# Altium project Sensor.PrjPcb
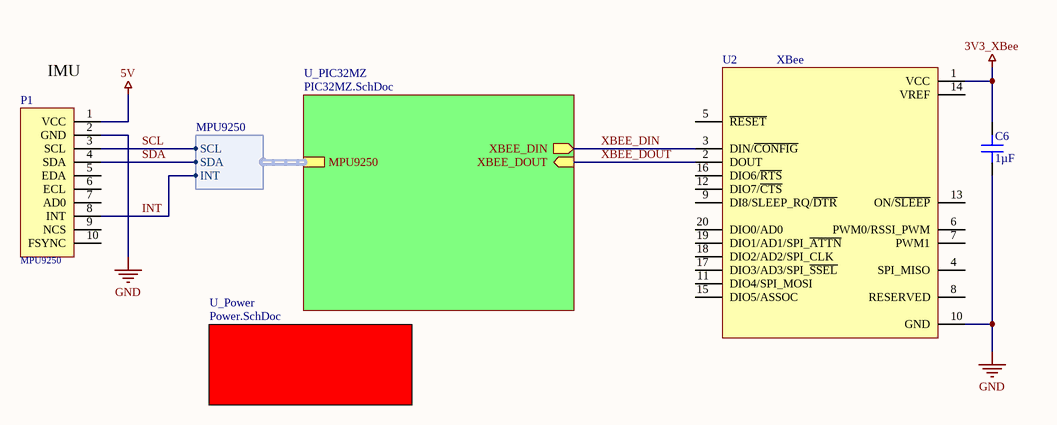
[diagram p0: Top.SchDoc]
5 sheets, 53 parts. Net scope: hierarchical (ports join the sheet entries above them; power ports are global).
Board file: Sensor.PcbDoc
Sheets:
  Top.SchDoc
    U_Power = Power.SchDoc
      U_5V_buck = 5V_buck.SchDoc
      U_3V3_LDO = 3V3_LDO.SchDoc
      U_3V3_LDO = 3V3_LDO.SchDoc
    U_PIC32MZ = PIC32MZ.SchDoc

## Sheet Top.SchDoc
size A; SheetNumber: 1; SheetTotal: 5

### Parts
C6  1µF  [CAP 0603_1608]
P1  MPU9250  [MPU 9150 - 10 pin 0.1"]
U2  XBee  [XBee]

### Sub-sheets
U_PIC32MZ = PIC32MZ.SchDoc: XBEE_DIN (out), XBEE_DOUT (in), MPU9250 (harness MPU9250)
U_Power = Power.SchDoc: no entries

### Harnesses
MPU9250: INT, SCL, SDA

### Nets
3V3_XBee: C6.2 U2.1(VCC)
5V: P1.1(VCC)
GND: C6.1 P1.2(GND) U2.10(GND)
INT: P1.8(INT) ; sheet U_PIC32MZ/MPU9250.INT
SCL: P1.3(SCL) ; sheet U_PIC32MZ/MPU9250.SCL
SDA: P1.4(SDA) ; sheet U_PIC32MZ/MPU9250.SDA
XBEE_DIN: U2.3(DIN/~{CONFIG}) ; sheet U_PIC32MZ/XBEE_DIN
XBEE_DOUT: U2.2(DOUT) ; sheet U_PIC32MZ/XBEE_DOUT

Not connected (* = marked no-connect by the designer): P1 5(EDA) 6(ECL) 7(AD0) 9(NCS) 10(FSYNC); U2 4(SPI_MISO) 5(~{RESET}) 6(PWM0/RSSI_PWM) 7(PWM1) 8(RESERVED) 9(DI8/SLEEP_RQ/~{DTR}) 11(DIO4/SPI_MOSI) 12(DIO7/~{CTS}) 13(ON/~{SLEEP}) 14(VREF) 15(DIO5/ASSOC) 16(DIO6/~{RTS}) 17(DIO3/AD3/SPI_~{SSEL}) 18(DIO2/AD2/SPI_CLK) 19(DIO1/AD1/SPI_~{ATTN}) 20(DIO0/AD0)

### Notes on the sheet
- (near P1) IMU

### Library data of the parts
C6 = GCJ188R71E105KA01D: CAP CER 1UF 25V X7R 0603; Manufacturer: Murata Electronics; Tolerance: ±10%; Part Number: GCJ188R71E105KA01D; Value: 1µF; Applications: Automotive, Boardflex Sensitive; Capacitance: 1µF; ComponentLink1Description: Datasheet; ComponentLink1URL: https://search.murata.co.jp/Ceramy/image/img/A01X/G101/ENG/GCJ188R71E105KA01-01.pdf; ComponentLink2Description: DigiKey Link; ComponentLink2URL: http://digikey.com/product-detail/en/murata-electronics/GCJ188R71E105KA01D/490-14409-1-ND/6606870; Device Package: 0603 (1608 Metric); Features: Soft Termination; LastUpdated: 21-Jan-20 12:01:58 AM; Lifecycle Status: Active; Minimum Order: 1; Mounting Type: Surface Mount, MLCC; Operating Temperature: -55°C ~ 125°C; Package / Case: 0603 (1608 Metric); Packaging: TapeAndReel; PartId: 9566; Part Status: Active; Price: 0.05; Ratings: AEC-Q200; Series: GCJ; Size / Dimension: 0.063" L x 0.031" W (1.60mm x 0.80mm); Supplier 1: DigiKey; Supplier Part Number 1: 490-14409-1-ND; Temperature Coefficient: X7R; Thickness (Max): 0.035" (0.90mm); Voltage - Rated: 25V
P1 = 9 DOF - MPU025 - Breakout: 9 DOF - MPU025- Breakout; Manufacturer Part Number: 61301011121; Manufacturer: Wurth Elektronik; Pin Number: 10; Pitch: 2.54mm; Gender: Pin Header; Rated Current: 3A; Working Voltage: 250VAC; Withstanding Voltage: 500VAC; Contact Resistance: 20mOhm; Row Number: Single; ComponentLink1Description: Manufacturer; ComponentLink1URL: http://www.we-online.de; ComponentLink2Description: Datasheet; ComponentLink2URL: https://www.we-online.com/catalog/datasheet/61301011121.pdf; Published Date: May 2020; Operating Temperature: -40 to +105degC; Mounting Technology: THT; Packaging: Bag; Orientation: Vertical
U2 = XBee: 802.15.4 Transceiver Module 2.4GHz Antenna Not Included, U.FL Through Hole

## Sheet Power.SchDoc
size A; SheetNumber: 3; SheetTotal: 5
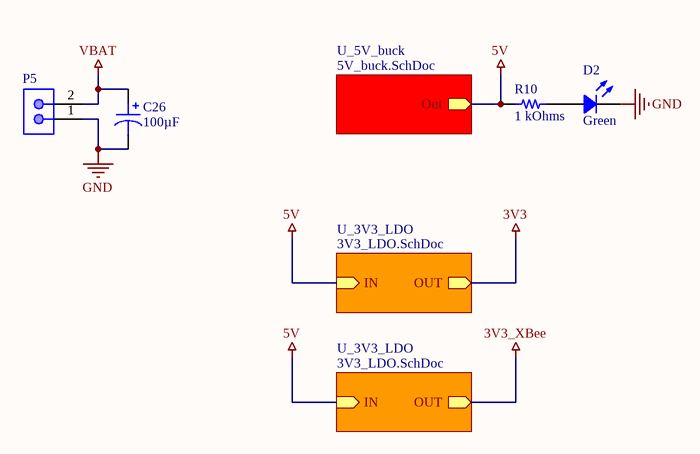
[diagram p1: Power.SchDoc]

### Parts
C26  100µF  [CAP POL 2917_7343]
D2  Green  [LED 0603_1608 GREEN]
P5  2 pin 2mm JST Male  [2pin - 2mm JST male]  (value not drawn)
R10  1 kOhms  [RES 0603_1608]

### Sub-sheets
U_3V3_LDO = 3V3_LDO.SchDoc: OUT (out), IN (in)
U_3V3_LDO = 3V3_LDO.SchDoc: OUT (out), IN (in)
U_5V_buck = 5V_buck.SchDoc: Out (out)

### Nets
5V: R10.1 ; sheet U_5V_buck/Out, sheet U_3V3_LDO/IN, sheet U_3V3_LDO/IN
GND: C26.2 D2.2 P5.1
VBAT: C26.1 P5.2
NetD2_1: D2.1 R10.2

### Library data of the parts
C26 = 293D107X0020E2TE3: CAP TANT 100UF 20% 20V 2917; Manufacturer: Vishay Sprague; Manufacturer Size Code: E; ESR (Equivalent Series Resistance): 500mOhm; Type: Molded; Part Number: 293D107X0020E2TE3; Value: 100µF; Capacitance: 100µF; ComponentLink1Description: Datasheet; ComponentLink1URL: http://www.vishay.com/docs/40002/293d.pdf; ComponentLink2Description: DigiKey Link; ComponentLink2URL: http://digikey.com/product-detail/en/vishay-sprague/293D107X0020E2TE3/718-293D107X0020E2TE3CT-ND/10507022; Device Package: 2917 (7343 Metric); Features: General Purpose; Height - Seated (Max): 0.170" (4.32mm); LastUpdated: 13-Aug-20 10:43:35 AM; Lifecycle Status: Active; Minimum Order: 1; Mounting Type: Surface Mount; Operating Temperature: -55°C ~ 125°C; Package / Case: 2917 (7343 Metric); Packaging: TapeAndReel; PartId: 1360; Part Status: Active; Price: 0.70; Series: TANTAMOUNT®, 293D; Size / Dimension: 0.287" L x 0.169" W (7.30mm x 4.30mm); Supplier 1: DigiKey; Supplier Part Number 1: 718-293D107X0020E2TE3CT-ND; Tolerance: ±20%
D2 = XZCDGK53W-8VF: 1.6X0.8MM LC GREEN PIXSOLED DOME; Manufacturer: SunLED; Configuration: Independent; Current - Test: 2mA; Lens Color: Colorless; Lens Size: 0.35mm Dia; Lens Style: Round with Domed Top; Lens Transparency: Clear; Millicandela Rating: 417mcd; Viewing Angle: 60°; Voltage - Forward (Vf) (Typ): 2.65V; Wavelength - Dominant: 525nm; Wavelength - Peak: 515nm; Part Number: XZCDGK53W-8VF; Color: Green; ComponentLink1Description: Datasheet; ComponentLink1URL: https://www.sunledusa.com/products/spec/XZCDGK53W-8VF.pdf; ComponentLink2Description: DigiKey Link; ComponentLink2URL: http://digikey.com/product-detail/en/sunled/XZCDGK53W-8VF/1497-XZCDGK53W-8VFCT-ND/10449792; Device Package: 0603 (1608 Metric); Height (Max): 1.10mm; LastUpdated: 21-Jan-20 3:12:09 AM; Lifecycle Status: Active; Minimum Order: 1; Mounting Type: Surface Mount; Package / Case: 0603 (1608 Metric); Packaging: Unknown; PartId: 938; Part Status: Active; Price: 0.18; Series: Ultra Low Current; Size / Dimension: 1.60mm L x 0.80mm W; Supplier 1: DigiKey; Supplier Part Number 1: 1497-XZCDGK53W-8VFCT-ND; Supplier Device Package: 2-SMD; Value: Green
R10 = RNCF0603DTE1K00: RES 1K OHM 0.5% 1/10W 0603; Manufacturer: Stackpole Electronics Inc; Power (Watts): 0.1W, 1/10W; Temperature Coefficient: ±25ppm/°C; Part Number: RNCF0603DTE1K00; Value: 1 kOhms; ComponentLink1Description: Datasheet; ComponentLink1URL: https://www.seielect.com/catalog/sei-rncf.pdf; ComponentLink2Description: DigiKey Link; ComponentLink2URL: http://digikey.com/product-detail/en/stackpole-electronics-inc/RNCF0603DTE1K00/RNCF0603DTE1K00CT-ND/9915086; Composition: Thin Film; Device Package: 0603 (1608 Metric); Features: Automotive AEC-Q200; Height - Seated (Max): 0.022" (0.55mm); LastUpdated: 21-Jan-20 12:14:28 AM; Lifecycle Status: Active; Minimum Order: 1; Number of Terminations: 2; Operating Temperature: -55°C ~ 155°C; Package / Case: 0603 (1608 Metric); Packaging: TapeAndReel; PartId: 26300; Part Status: Active; Price: 0.05; Ratings: AEC-Q200; Resistance: 1 kOhms; Series: RNCF; Size / Dimension: 0.061" L x 0.031" W (1.55mm x 0.80mm); Supplier 1: DigiKey; Supplier Part Number 1: RNCF0603DTE1K00CT-ND; Supplier Device Package: 0603; Tolerance: ±0.5%

## Sheet 5V_buck.SchDoc
size A; SheetNumber: 5; SheetTotal: 5
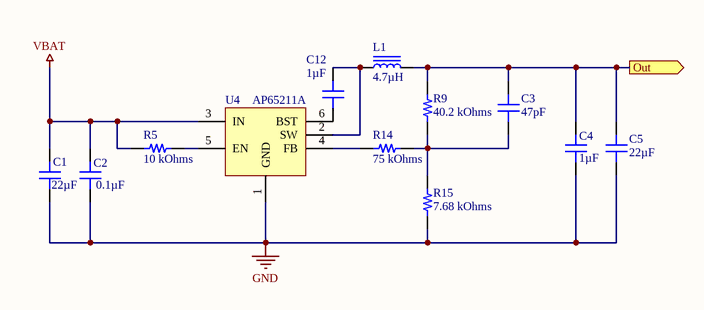
[diagram p2: 5V_buck.SchDoc]

### Parts
C1  22µF  [CAP 0805_2012]
C2  0.1µF  [CAP 0603_1608]
C3  47pF  [CAP 0603_1608]
C4  1µF  [CAP 0603_1608]
C5  22µF  [CAP 0805_2012]
C12  1µF  [CAP 0603_1608]
L1  4.7µH  [IND 1008_2520]
R5  10 kOhms  [RES 0603_1608]
R9  40.2 kOhms  [RES 0603_1608]
R14  75 kOhms  [RES 0603_1608]
R15  7.68 kOhms  [RES 0603_1608]
U4  AP65211A  [TSOT-26-6]

### Ports
Out (out)

### Nets
5V: C3.2 C4.2 C5.2 L1.2 R9.2 ; port Out
GND: C1.1 C2.2 C4.1 C5.1 R15.1 U4.1(GND)
VBAT: C1.2 C2.1 R5.2 U4.3(IN)
NetC3_1: C3.1 R9.1 R14.2 R15.2
NetC12_1: C12.1 L1.1 U4.2(SW)
NetC12_2: C12.2 U4.6(BST)
NetR5_1: R5.1 U4.5(EN)
NetR14_1: R14.1 U4.4(FB)

### Library data of the parts
C1 = C2012X7S1E106K125AC: CAP CER 10UF 25V X7S 0805; Manufacturer: TDK Corporation; Capacitance: 10µF; Tolerance: ±10%; Part Number: C2012X7S1E106K125AC; Value: 22µF; Applications: General Purpose; ComponentLink1Description: Datasheet; ComponentLink1URL: https://product.tdk.com/en/search/capacitor/ceramic/mlcc/info?part_no=C2012X7S1E106K125AC?ref_disty=digikey; ComponentLink2Description: DigiKey Link; ComponentLink2URL: http://digikey.com/product-detail/en/tdk-corporation/C2012X7S1E106K125AC/445-181600-1-ND/9991478; Device Package: 0805 (2012 Metric); Features: Low ESL; LastUpdated: 21-Jan-20 12:03:04 AM; Lifecycle Status: Active; Minimum Order: 1; Mounting Type: Surface Mount, MLCC; Operating Temperature: -55°C ~ 125°C; Package / Case: 0805 (2012 Metric); Packaging: TapeAndReel; PartId: 3339; Part Status: Active; Price: 0.15; Series: C; Size / Dimension: 0.079" L x 0.049" W (2.00mm x 1.25mm); Supplier 1: DigiKey; Supplier Part Number 1: 445-181600-1-ND; Temperature Coefficient: X7S; Thickness (Max): 0.057" (1.45mm); Voltage - Rated: 25V
C2 = GCG188R92A104KA03D: CAP CER 0.1UF 100V 0603 EPOXY; Manufacturer: Murata Electronics; Temperature Coefficient: X8R; Tolerance: ±10%; Part Number: GCG188R92A104KA03D; Value: 0.1µF; Applications: Automotive; Capacitance: 0.1µF; ComponentLink1Description: Datasheet; ComponentLink1URL: https://search.murata.co.jp/Ceramy/image/img/A01X/G101/ENG/GCG188R92A104KA03-01.pdf; ComponentLink2Description: DigiKey Link; ComponentLink2URL: http://digikey.com/product-detail/en/murata-electronics/GCG188R92A104KA03D/490-18197-1-ND/9867926; Device Package: 0603 (1608 Metric); Features: Epoxy Mountable; LastUpdated: 21-Jan-20 12:01:59 AM; Lifecycle Status: Active; Minimum Order: 1; Mounting Type: Surface Mount, MLCC, Epoxy; Operating Temperature: -55°C ~ 150°C; Package / Case: 0603 (1608 Metric); Packaging: TapeAndReel; PartId: 9025; Part Status: Active; Price: 0.07; Ratings: AEC-Q200; Series: GCG; Size / Dimension: 0.063" L x 0.031" W (1.60mm x 0.80mm); Supplier 1: DigiKey; Supplier Part Number 1: 490-18197-1-ND; Thickness (Max): 0.035" (0.90mm); Voltage - Rated: 100V
C3 = C1608NP02A470J080AA: CAP CER 47PF 100V NP0 0603; Manufacturer: TDK Corporation; Temperature Coefficient: C0G, NP0; Tolerance: ±5%; Part Number: C1608NP02A470J080AA; Value: 47pF; Applications: General Purpose; Capacitance: 47pF; ComponentLink1Description: Datasheet; ComponentLink1URL: https://product.tdk.com/info/en/catalog/datasheets/mlcc_commercial_hightemp_en.pdf?ref_disty=digikey; ComponentLink2Description: DigiKey Link; ComponentLink2URL: http://digikey.com/product-detail/en/tdk-corporation/C1608NP02A470J080AA/445-14125-1-ND/3955791; Device Package: 0603 (1608 Metric); Features: High Temperature; LastUpdated: 13-Aug-20 10:25:18 AM; Lifecycle Status: Active; Minimum Order: 1; Mounting Type: Surface Mount, MLCC; Operating Temperature: -55°C ~ 150°C; Package / Case: 0603 (1608 Metric); Packaging: TapeAndReel; PartId: 7049; Part Status: Active; Price: 0.04; Series: C; Size / Dimension: 0.063" L x 0.031" W (1.60mm x 0.80mm); Supplier 1: DigiKey; Supplier Part Number 1: 445-14125-1-ND; Thickness (Max): 0.035" (0.90mm)
C4 C12 = GCJ188R71E105KA01D: as C6 on sheet Top; Part Number: GCJ188R71E105KA01D; Value: 1µF; Applications: Automotive, Boardflex Sensitive; Capacitance: 1µF; ComponentLink1Description: Datasheet; ComponentLink1URL: https://search.murata.co.jp/Ceramy/image/img/A01X/G101/ENG/GCJ188R71E105KA01-01.pdf; ComponentLink2Description: DigiKey Link; ComponentLink2URL: http://digikey.com/product-detail/en/murata-electronics/GCJ188R71E105KA01D/490-14409-1-ND/6606870; Device Package: 0603 (1608 Metric); Features: Soft Termination; LastUpdated: 13-Aug-20 10:24:06 AM; Lifecycle Status: Active; Minimum Order: 1; Mounting Type: Surface Mount, MLCC; Operating Temperature: -55°C ~ 125°C; Package / Case: 0603 (1608 Metric); Packaging: TapeAndReel; PartId: 9566; Part Status: Active; Price: 0.05; Ratings: AEC-Q200; Series: GCJ; Size / Dimension: 0.063" L x 0.031" W (1.60mm x 0.80mm); Supplier 1: DigiKey; Supplier Part Number 1: 490-14409-1-ND; Temperature Coefficient: X7R; Thickness (Max): 0.035" (0.90mm)
C5 = CL21A226MOQNNNE: CAP CER 22UF 16V X5R 0805; Manufacturer: Samsung Electro-Mechanics; Tolerance: ±20%; Part Number: CL21A226MOQNNNE; Value: 22µF; Applications: General Purpose; Capacitance: 22µF; ComponentLink1Description: Datasheet; ComponentLink1URL: http://www.samsungsem.com/kr/support/product-search/mlcc/CL21A226MOQNNNE.jsp; ComponentLink2Description: DigiKey Link; ComponentLink2URL: http://digikey.com/product-detail/en/samsung-electro-mechanics/CL21A226MOQNNNE/1276-2909-1-ND/3890995; Device Package: 0805 (2012 Metric); LastUpdated: 21-Jan-20 12:03:05 AM; Lifecycle Status: Active; Minimum Order: 1; Mounting Type: Surface Mount, MLCC; Operating Temperature: -55°C ~ 85°C; Package / Case: 0805 (2012 Metric); Packaging: TapeAndReel; PartId: 3052; Part Status: Active; Price: 0.11; Series: CL; Size / Dimension: 0.079" L x 0.049" W (2.00mm x 1.25mm); Supplier 1: DigiKey; Supplier Part Number 1: 1276-2909-1-ND; Temperature Coefficient: X5R; Thickness (Max): 0.055" (1.40mm); Voltage - Rated: 16V
L1 = MLP2520S4R7ST0S1: FIXED IND 4.7UH 1A 110 MOHM SMD; Manufacturer: TDK Corporation; DC Resistance (DCR): 143mOhm Max; Inductance Frequency - Test: 2MHz; Material - Core: Ferrite; Shielding: Shielded; Tolerance: ±20%; Type: Multilayer; Part Number: MLP2520S4R7ST0S1; ComponentLink1Description: Datasheet; ComponentLink1URL: https://product.tdk.com/info/en/catalog/datasheets/inductor_commercial_power_mlp2520_en.pdf?ref_disty=digikey; ComponentLink2Description: DigiKey Link; ComponentLink2URL: http://digikey.com/product-detail/en/tdk-corporation/MLP2520S4R7ST0S1/445-6378-1-ND/2465705; Current Rating (Amps): 1A; Device Package: 1008 (2520 Metric); Height - Seated (Max): 0.039" (1.00mm); Inductance: 4.7µH; LastUpdated: 13-Aug-20 11:03:40 AM; Lifecycle Status: Active; Minimum Order: 1; Mounting Type: Surface Mount; Operating Temperature: -40°C ~ 125°C; Package / Case: 1008 (2520 Metric); Packaging: TapeAndReel; PartId: 3467; Part Status: Active; Price: 0.14; Series: MLP; Size / Dimension: 0.098" L x 0.079" W (2.50mm x 2.00mm); Supplier 1: DigiKey; Supplier Part Number 1: 445-6378-1-ND; Supplier Device Package: 1008 (2520 Metric); Value: 4.7µH
R5 = RNCS0603BKE10K0: RES 10K OHM 0.1% 1/16W 0603; Manufacturer: Stackpole Electronics Inc; Power (Watts): 0.063W, 1/16W; Temperature Coefficient: ±25ppm/°C; Part Number: RNCS0603BKE10K0; Value: 10 kOhms; ComponentLink1Description: Datasheet; ComponentLink1URL: https://www.seielect.com/catalog/sei-rncs_rnch.pdf; ComponentLink2Description: DigiKey Link; ComponentLink2URL: http://digikey.com/product-detail/en/stackpole-electronics-inc/RNCS0603BKE10K0/RNCS0603BKE10K0CT-ND/1800113; Composition: Thin Film; Device Package: 0603 (1608 Metric); Features: Anti-Corrosive, Automotive AEC-Q200, Moisture Resistant; Height - Seated (Max): 0.022" (0.55mm); LastUpdated: 21-Jan-20 12:25:01 AM; Lifecycle Status: Active; Minimum Order: 1; Number of Terminations: 2; Operating Temperature: -55°C ~ 155°C; Package / Case: 0603 (1608 Metric); Packaging: TapeAndReel; PartId: 4838; Part Status: Active; Price: 0.08; Ratings: AEC-Q200; Resistance: 10 kOhms; Series: RNCS; Size / Dimension: 0.061" L x 0.031" W (1.55mm x 0.80mm); Supplier 1: DigiKey; Supplier Part Number 1: RNCS0603BKE10K0CT-ND; Supplier Device Package: 0603; Tolerance: ±0.1%
R9 = RT0603DRD0740K2L: RES SMD 40.2KOHM 0.5% 1/10W 0603; Manufacturer: Yageo; Power (Watts): 0.1W, 1/10W; Temperature Coefficient: ±25ppm/°C; Part Number: RT0603DRD0740K2L; Value: 40.2 kOhms; ComponentLink1Description: Datasheet; ComponentLink1URL: https://www.yageo.com/upload/media/product/productsearch/datasheet/rchip/PYu-RT_1-to-0.01_RoHS_L_11.pdf; ComponentLink2Description: DigiKey Link; ComponentLink2URL: http://digikey.com/product-detail/en/yageo/RT0603DRD0740K2L/311-40.2KDCT-ND/1035817; Composition: Thin Film; Device Package: 0603 (1608 Metric); Height - Seated (Max): 0.022" (0.55mm); LastUpdated: 13-Aug-20 10:36:48 AM; Lifecycle Status: Active; Minimum Order: 1; Number of Terminations: 2; Operating Temperature: -55°C ~ 155°C; Package / Case: 0603 (1608 Metric); Packaging: TapeAndReel; PartId: 18076; Part Status: Active; Price: 0.02; Resistance: 40.2 kOhms; Series: RT; Size / Dimension: 0.063" L x 0.031" W (1.60mm x 0.80mm); Supplier 1: DigiKey; Supplier Part Number 1: 311-40.2KDCT-ND; Supplier Device Package: 0603; Tolerance: ±0.5%
R14 = CR0603-JW-753ELF: RES SMD 75K OHM 5% 1/10W 0603; Manufacturer: Bourns Inc.; Power (Watts): 0.1W, 1/10W; Temperature Coefficient: ±200ppm/°C; Part Number: CR0603-JW-753ELF; Value: 75 kOhms; ComponentLink1Description: Datasheet; ComponentLink1URL: https://www.bourns.com/docs/Product-Datasheets/CHPREZTR.pdf; ComponentLink2Description: DigiKey Link; ComponentLink2URL: http://digikey.com/product-detail/en/bourns-inc/CR0603-JW-753ELF/CR0603-JW-753ELFCT-ND/4247893; Composition: Thick Film; Device Package: 0603 (1608 Metric); Features: Moisture Resistant; Height - Seated (Max): 0.022" (0.55mm); LastUpdated: 13-Aug-20 10:36:37 AM; Lifecycle Status: Active; Minimum Order: 1; Number of Terminations: 2; Operating Temperature: -55°C ~ 155°C; Package / Case: 0603 (1608 Metric); Packaging: CutTape; PartId: 23428; Part Status: Active; Price: 0.10; Resistance: 75 kOhms; Series: CR0603; Size / Dimension: 0.063" L x 0.031" W (1.60mm x 0.80mm); Supplier 1: DigiKey; Supplier Part Number 1: CR0603-JW-753ELFCT-ND; Supplier Device Package: 0603; Tolerance: ±5%
R15 = RMCF0603FT7K68: RES 7.68K OHM 1% 1/10W 0603; Manufacturer: Stackpole Electronics Inc; Power (Watts): 0.1W, 1/10W; Temperature Coefficient: ±100ppm/°C; Part Number: RMCF0603FT7K68; Value: 7.68 kOhms; ComponentLink1Description: Datasheet; ComponentLink1URL: https://www.seielect.com/catalog/sei-rmcf_rmcp.pdf; ComponentLink2Description: DigiKey Link; ComponentLink2URL: http://digikey.com/product-detail/en/stackpole-electronics-inc/RMCF0603FT7K68/RMCF0603FT7K68CT-ND/4425120; Composition: Thick Film; Device Package: 0603 (1608 Metric); Features: Automotive AEC-Q200; Height - Seated (Max): 0.022" (0.55mm); LastUpdated: 13-Aug-20 10:36:44 AM; Lifecycle Status: Active; Minimum Order: 1; Number of Terminations: 2; Operating Temperature: -55°C ~ 155°C; Package / Case: 0603 (1608 Metric); Packaging: CutTape; PartId: 20370; Part Status: Active; Price: 0.10; Ratings: AEC-Q200; Resistance: 7.68 kOhms; Series: RMCF; Size / Dimension: 0.061" L x 0.031" W (1.55mm x 0.80mm); Supplier 1: DigiKey; Supplier Part Number 1: RMCF0603FT7K68CT-ND; Supplier Device Package: 0603; Tolerance: ±1%
U4 = AP65211A: ADJ step down Buck

## Sheet 3V3_LDO.SchDoc
size A; SheetNumber: 4; SheetTotal: 5
Used 2 times, as channels U_Power/U_3V3_LDO, U_Power/U_3V3_LDO. Parts and nets are listed once, with the designators drawn on the sheet.
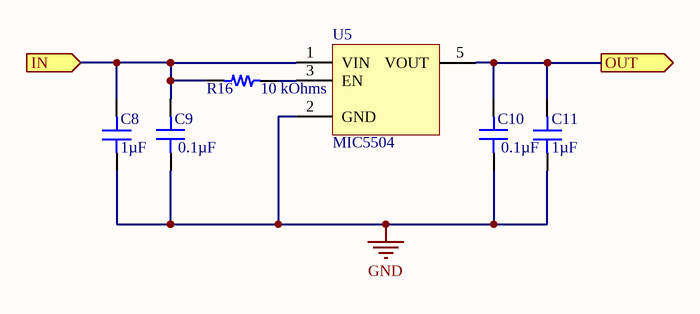
[diagram p3: 3V3_LDO.SchDoc]

### Parts
C8  1µF  [CAP 0603_1608]
C9  0.1µF  [CAP 0603_1608]
C10  0.1µF  [CAP 0603_1608]
C11  1µF  [CAP 0603_1608]
R16  10 kOhms  [RES 0603_1608]
U5  MIC5504  [TI SOT-23-5 DBV]

### Ports
IN (in), OUT (out)

### Nets
GND: C8.1 C9.2 C10.2 C11.1 U5.2(GND)
IN: C8.2 C9.1 R16.2 U5.1(VIN) ; port IN
OUT: C10.1 C11.2 U5.5(VOUT) ; port OUT
NetR16_1: R16.1 U5.3(EN)

### Channels
U_Power/U_3V3_LDO: designators end in _2; ports IN=5V OUT=3V3
U_Power/U_3V3_LDO: designators end in _1; ports IN=5V OUT=3V3_XBee

### Library data of the parts
C8 C11 = GCJ188R71E105KA01D: as C6 on sheet Top; Part Number: GCJ188R71E105KA01D; Value: 1µF; Applications: Automotive, Boardflex Sensitive; Capacitance: 1µF; ComponentLink1Description: Datasheet; ComponentLink1URL: https://search.murata.co.jp/Ceramy/image/img/A01X/G101/ENG/GCJ188R71E105KA01-01.pdf; ComponentLink2Description: DigiKey Link; ComponentLink2URL: http://digikey.com/product-detail/en/murata-electronics/GCJ188R71E105KA01D/490-14409-1-ND/6606870; Device Package: 0603 (1608 Metric); Features: Soft Termination; LastUpdated: 13-Aug-20 10:24:06 AM; Lifecycle Status: Active; Minimum Order: 1; Mounting Type: Surface Mount, MLCC; Operating Temperature: -55°C ~ 125°C; Package / Case: 0603 (1608 Metric); Packaging: TapeAndReel; PartId: 9566; Part Status: Active; Price: 0.05; Ratings: AEC-Q200; Series: GCJ; Size / Dimension: 0.063" L x 0.031" W (1.60mm x 0.80mm); Supplier 1: DigiKey; Supplier Part Number 1: 490-14409-1-ND; Temperature Coefficient: X7R; Thickness (Max): 0.035" (0.90mm)
C9 C10 = GCG188R92A104KA03D: as C2 on sheet 5V_buck; Part Number: GCG188R92A104KA03D; Value: 0.1µF; Applications: Automotive; Capacitance: 0.1µF; ComponentLink1Description: Datasheet; ComponentLink1URL: https://search.murata.co.jp/Ceramy/image/img/A01X/G101/ENG/GCG188R92A104KA03-01.pdf; ComponentLink2Description: DigiKey Link; ComponentLink2URL: http://digikey.com/product-detail/en/murata-electronics/GCG188R92A104KA03D/490-18197-1-ND/9867926; Device Package: 0603 (1608 Metric); Features: Epoxy Mountable; LastUpdated: 21-Jan-20 12:01:59 AM; Lifecycle Status: Active; Minimum Order: 1; Mounting Type: Surface Mount, MLCC, Epoxy; Operating Temperature: -55°C ~ 150°C; Package / Case: 0603 (1608 Metric); Packaging: TapeAndReel; PartId: 9025; Part Status: Active; Price: 0.07; Ratings: AEC-Q200; Series: GCG; Size / Dimension: 0.063" L x 0.031" W (1.60mm x 0.80mm); Supplier 1: DigiKey; Supplier Part Number 1: 490-18197-1-ND; Thickness (Max): 0.035" (0.90mm); Voltage - Rated: 100V
R16 = RNCS0603BKE10K0: as R5 on sheet 5V_buck; Part Number: RNCS0603BKE10K0; Value: 10 kOhms; ComponentLink1Description: Datasheet; ComponentLink1URL: https://www.seielect.com/catalog/sei-rncs_rnch.pdf; ComponentLink2Description: DigiKey Link; ComponentLink2URL: http://digikey.com/product-detail/en/stackpole-electronics-inc/RNCS0603BKE10K0/RNCS0603BKE10K0CT-ND/1800113; Composition: Thin Film; Device Package: 0603 (1608 Metric); Features: Anti-Corrosive, Automotive AEC-Q200, Moisture Resistant; Height - Seated (Max): 0.022" (0.55mm); LastUpdated: 21-Jan-20 12:25:01 AM; Lifecycle Status: Active; Minimum Order: 1; Number of Terminations: 2; Operating Temperature: -55°C ~ 155°C; Package / Case: 0603 (1608 Metric); Packaging: TapeAndReel; PartId: 4838; Part Status: Active; Price: 0.08; Ratings: AEC-Q200; Resistance: 10 kOhms; Series: RNCS; Size / Dimension: 0.061" L x 0.031" W (1.55mm x 0.80mm); Supplier 1: DigiKey; Supplier Part Number 1: RNCS0603BKE10K0CT-ND; Supplier Device Package: 0603; Tolerance: ±0.1%
U5 = MIC5504-3.3YM5: 3.3V LDO

## Sheet PIC32MZ.SchDoc
size B; SheetNumber: 2; SheetTotal: 5
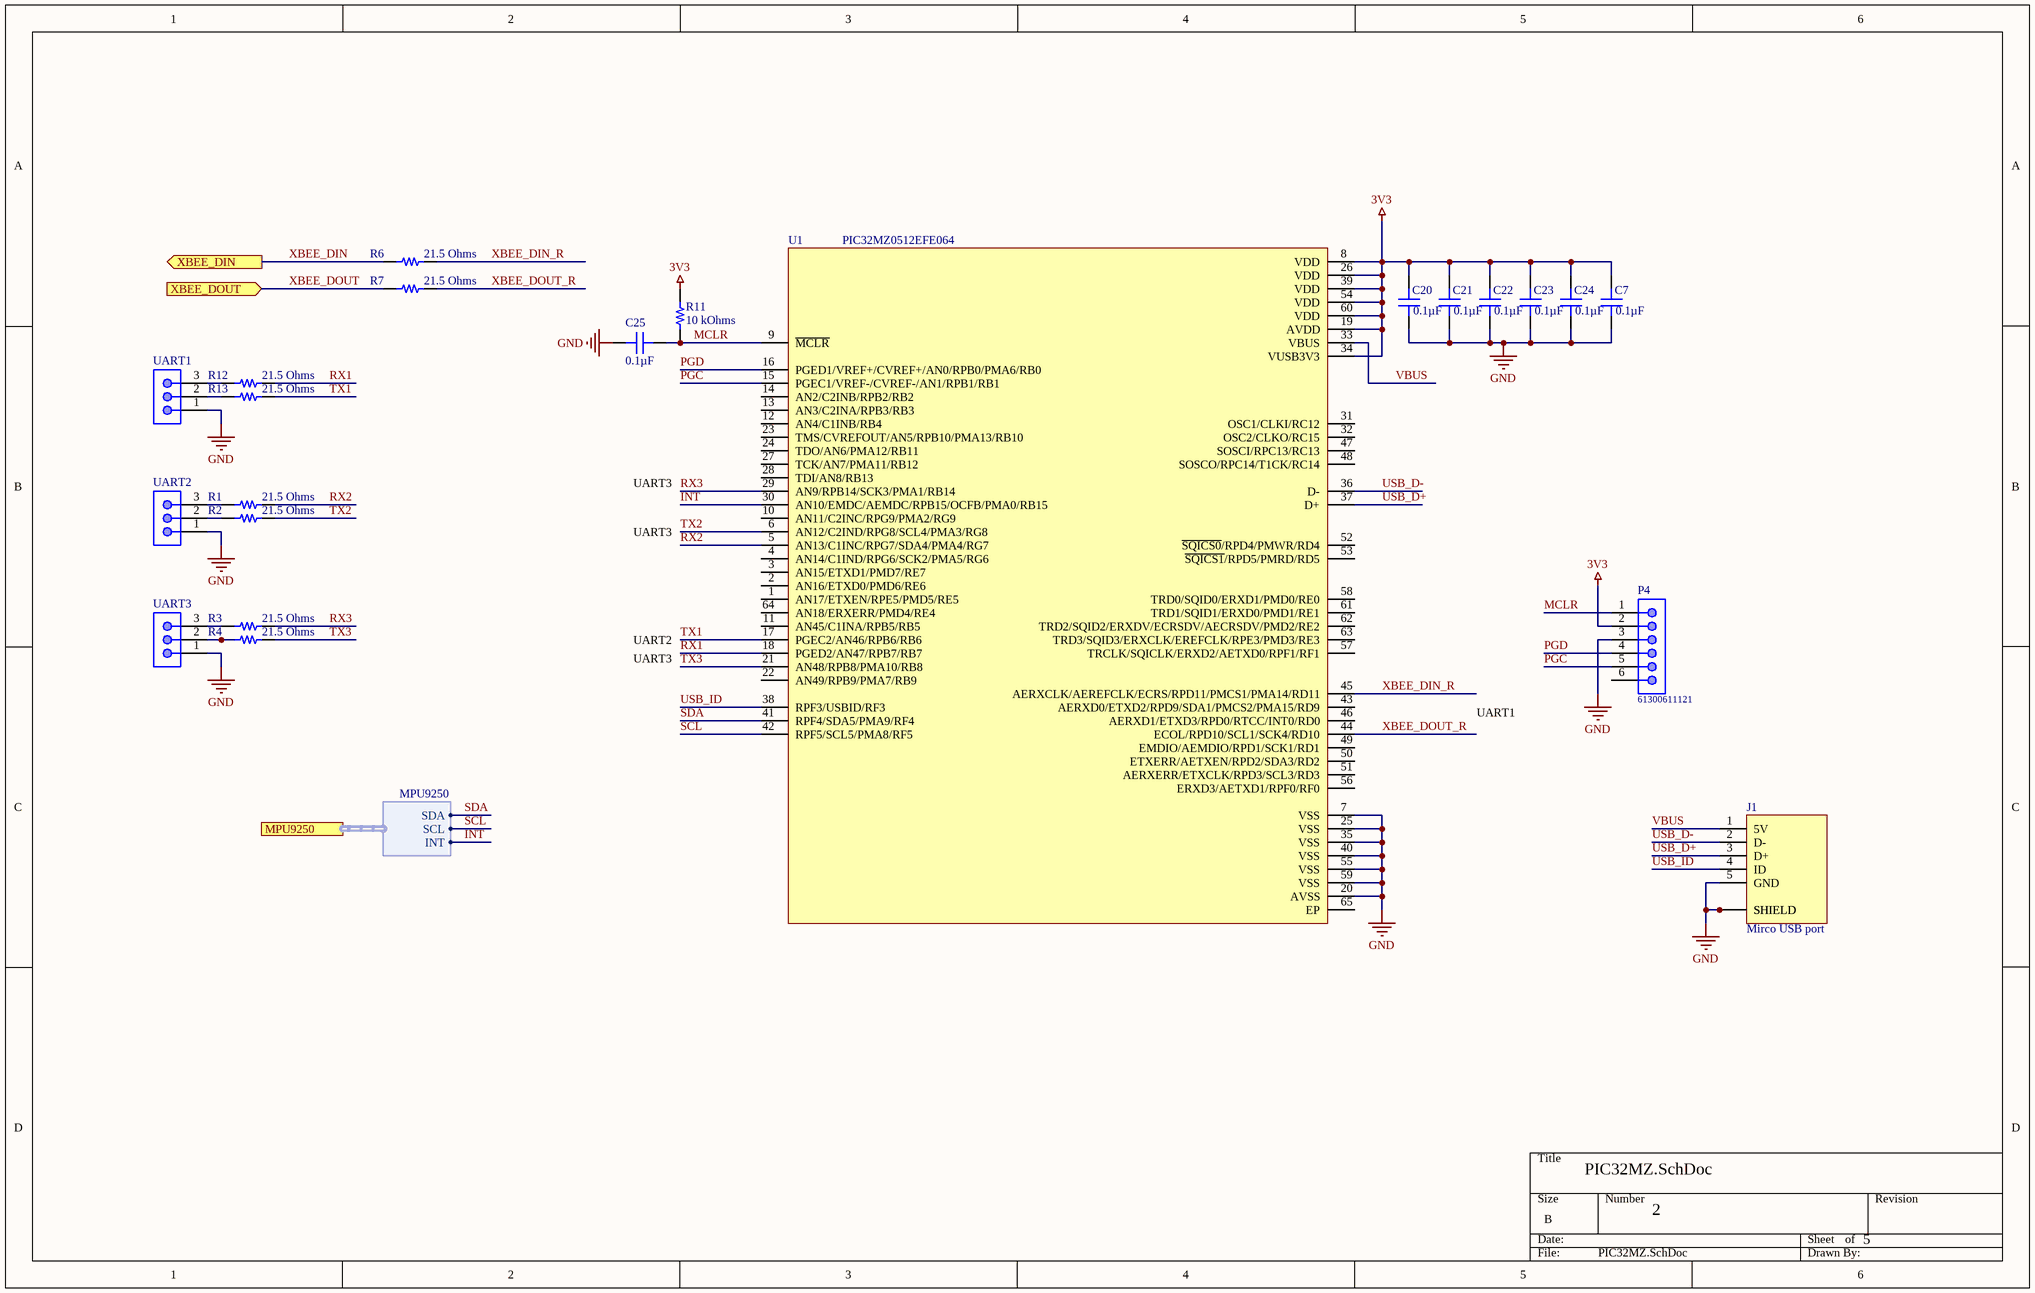
[diagram p4: PIC32MZ.SchDoc]

### Parts
C7  0.1µF  [CAP 0603_1608]
C20  0.1µF  [CAP 0603_1608]
C21  0.1µF  [CAP 0603_1608]
C22  0.1µF  [CAP 0603_1608]
C23  0.1µF  [CAP 0603_1608]
C24  0.1µF  [CAP 0603_1608]
C25  0.1µF  [CAP 0603_1608]
J1  Mirco USB port  [AMPHENOL_10118194-0001LF]
P4  61300611121  [61300611121]
R1  21.5 Ohms  [RES 0603_1608]
R2  21.5 Ohms  [RES 0603_1608]
R3  21.5 Ohms  [RES 0603_1608]
R4  21.5 Ohms  [RES 0603_1608]
R6  21.5 Ohms  [RES 0603_1608]
R7  21.5 Ohms  [RES 0603_1608]
R11  10 kOhms  [RES 0603_1608]
R12  21.5 Ohms  [RES 0603_1608]
R13  21.5 Ohms  [RES 0603_1608]
U1  PIC32MZ0512EFE064  [QFN50P900X900X100-65N]
UART1  3 pin 2mm JST Male  [3pin - 2mm header]  (value not drawn)
UART2  3 pin 2mm JST Male  [3pin - 2mm header]  (value not drawn)
UART3  3 pin 2mm JST Male  [3pin - 2mm header]  (value not drawn)

### Ports
MPU9250 (harness MPU9250), XBEE_DIN (out), XBEE_DOUT (in)

### Harnesses
MPU9250: SDA, SCL, INT

### Nets
3V3: C7.1 C20.1 C21.1 C22.1 C23.1 C24.1 P4.2 R11.2 U1.8(VDD) U1.19(AVDD) U1.26(VDD) U1.34(VUSB3V3) U1.39(VDD) U1.54(VDD) U1.60(VDD)
GND: C7.2 C20.2 C21.2 C22.2 C23.2 C24.2 C25.2 J1.5(GND) J1.S1(SHIELD) J1.S2(SHIELD) J1.S3(SHIELD) J1.S4(SHIELD) J1.S5(SHIELD) J1.S6(SHIELD) P4.3 U1.7(VSS) U1.20(AVSS) U1.25(VSS) U1.35(VSS) U1.40(VSS) U1.55(VSS) U1.59(VSS) UART1.1 UART2.1 UART3.1
INT: U1.30(AN10/EMDC/AEMDC/RPB15/OCFB/PMA0/RB15) ; port MPU9250.INT
MCLR: C25.1 P4.1 R11.1 U1.9(~{MCLR})
PGC: P4.5 U1.15(PGEC1/VREF-/CVREF-/AN1/RPB1/RB1)
PGD: P4.4 U1.16(PGED1/VREF+/CVREF+/AN0/RPB0/PMA6/RB0)
RX1: R12.2 U1.18(PGED2/AN47/RPB7/RB7)
RX2: R1.2 U1.5(AN13/C1INC/RPG7/SDA4/PMA4/RG7)
RX3: R3.2 U1.29(AN9/RPB14/SCK3/PMA1/RB14)
SCL: U1.42(RPF5/SCL5/PMA8/RF5) ; port MPU9250.SCL
SDA: U1.41(RPF4/SDA5/PMA9/RF4) ; port MPU9250.SDA
TX1: R13.2 U1.17(PGEC2/AN46/RPB6/RB6)
TX2: R2.2 U1.6(AN12/C2IND/RPG8/SCL4/PMA3/RG8)
TX3: R4.2 U1.21(AN48/RPB8/PMA10/RB8)
USB_D+: J1.3(D+) U1.37(D+)
USB_D-: J1.2(D-) U1.36(D-)
USB_ID: J1.4(ID) U1.38(RPF3/USBID/RF3)
VBUS: J1.1(5V) U1.33(VBUS)
XBEE_DIN: R6.1 ; port XBEE_DIN
XBEE_DIN_R: R6.2 U1.45(AERXCLK/AEREFCLK/ECRS/RPD11/PMCS1/PMA14/RD11)
XBEE_DOUT: R7.1 ; port XBEE_DOUT
XBEE_DOUT_R: R7.2 U1.44(ECOL/RPD10/SCL1/SCK4/RD10)
NetR1_1: R1.1 UART2.3
NetR2_1: R2.1 UART2.2
NetR3_1: R3.1 UART3.3
NetR4_1: R4.1 UART3.2
NetR12_1: R12.1 UART1.3
NetR13_1: R13.1 UART1.2

Not connected (* = marked no-connect by the designer): P4 6; U1 1(AN17/ETXEN/RPE5/PMD5/RE5) 2(AN16/ETXD0/PMD6/RE6) 3(AN15/ETXD1/PMD7/RE7) 4(AN14/C1IND/RPG6/SCK2/PMA5/RG6) 10(AN11/C2INC/RPG9/PMA2/RG9) 11(AN45/C1INA/RPB5/RB5) 12(AN4/C1INB/RB4) 13(AN3/C2INA/RPB3/RB3) 14(AN2/C2INB/RPB2/RB2) 22(AN49/RPB9/PMA7/RB9) 23(TMS/CVREFOUT/AN5/RPB10/PMA13/RB10) 24(TDO/AN6/PMA12/RB11) 27(TCK/AN7/PMA11/RB12) 28(TDI/AN8/RB13) 31(OSC1/CLKI/RC12) 32(OSC2/CLKO/RC15) 43(AERXD0/ETXD2/RPD9/SDA1/PMCS2/PMA15/RD9) 46(AERXD1/ETXD3/RPD0/RTCC/INT0/RD0) 47(SOSCI/RPC13/RC13) 48(SOSCO/RPC14/T1CK/RC14) 49(EMDIO/AEMDIO/RPD1/SCK1/RD1) 50(ETXERR/AETXEN/RPD2/SDA3/RD2) 51(AERXERR/ETXCLK/RPD3/SCL3/RD3) 52(~{SQICS0}/RPD4/PMWR/RD4) 53(~{SQICS1}/RPD5/PMRD/RD5) 56(ERXD3/AETXD1/RPF0/RF0) 57(TRCLK/SQICLK/ERXD2/AETXD0/RPF1/RF1) 58(TRD0/SQID0/ERXD1/PMD0/RE0) 61(TRD1/SQID1/ERXD0/PMD1/RE1) 62(TRD2/SQID2/ERXDV/ECRSDV/AECRSDV/PMD2/RE2) 63(TRD3/SQID3/ERXCLK/EREFCLK/RPE3/PMD3/RE3) 64(AN18/ERXERR/PMD4/RE4) 65(EP)

### Notes on the sheet
- UART3
- UART2
- UART1

### Library data of the parts
C7 C20-C25 = GCG188R92A104KA03D: as C2 on sheet 5V_buck; Part Number: GCG188R92A104KA03D; Value: 0.1µF; Applications: Automotive; Capacitance: 0.1µF; ComponentLink1Description: Datasheet; ComponentLink1URL: https://search.murata.co.jp/Ceramy/image/img/A01X/G101/ENG/GCG188R92A104KA03-01.pdf; ComponentLink2Description: DigiKey Link; ComponentLink2URL: http://digikey.com/product-detail/en/murata-electronics/GCG188R92A104KA03D/490-18197-1-ND/9867926; Device Package: 0603 (1608 Metric); Features: Epoxy Mountable; LastUpdated: 21-Jan-20 12:01:59 AM; Lifecycle Status: Active; Minimum Order: 1; Mounting Type: Surface Mount, MLCC, Epoxy; Operating Temperature: -55°C ~ 150°C; Package / Case: 0603 (1608 Metric); Packaging: TapeAndReel; PartId: 9025; Part Status: Active; Price: 0.07; Ratings: AEC-Q200; Series: GCG; Size / Dimension: 0.063" L x 0.031" W (1.60mm x 0.80mm); Supplier 1: DigiKey; Supplier Part Number 1: 490-18197-1-ND; Thickness (Max): 0.035" (0.90mm); Voltage - Rated: 100V
J1 = 10118194-0001LF: USB - micro B USB 2.0 Receptacle Connector 5 Position Surface Mount, Right Angle; Through Hole; MF: Amphenol ICC; Package: None; Price: None; Availability: Unavailable; MP: 10118194-0001LF; SnapEDA_Link: https://www.snapeda.com/parts/10118194-0001LF/Amphenol%20FCI/view-part/1413308/?ref=snap; Value: *
P4 = 61300611121: WR-PHD Pin Header, THT, pitch 2.54mm, Single Row, Vertical, 6p; Manufacturer: Wurth Elektronik; Pin Number: 6; Rated Current: 3A; Working Voltage: 250VAC; Withstanding Voltage: 500VAC; Contact Resistance: 20mOhm; ComponentLink1Description: Manufacturer; ComponentLink1URL: http://www.we-online.de; ComponentLink2Description: Datasheet; ComponentLink2URL: https://www.we-online.com/catalog/datasheet/61300611121.pdf; Manufacturer Part Number: 61300611121; Published Date: May 2020; Pitch: 2.54mm; Operating Temperature: -40 to +105degC; Mounting Technology: THT; Packaging: Bag; Gender: Pin Header; Row Number: Single; Orientation: Vertical
R1-R4 R6 R7 R12 R13 = ERJ-3EKF21R5V: RES SMD 21.5 OHM 1% 1/10W 0603; Manufacturer: Panasonic Electronic Components; Power (Watts): 0.1W, 1/10W; Temperature Coefficient: ±100ppm/°C; Part Number: ERJ-3EKF21R5V; Value: 21.5 Ohms; ComponentLink1Description: Datasheet; ComponentLink1URL: https://industrial.panasonic.com/cdbs/www-data/pdf/RDA0000/AOA0000C304.pdf; ComponentLink2Description: DigiKey Link; ComponentLink2URL: http://digikey.com/product-detail/en/panasonic-electronic-components/ERJ-3EKF21R5V/P21.5HCT-ND/198246; Composition: Thick Film; Device Package: 0603 (1608 Metric); Features: Automotive AEC-Q200; Height - Seated (Max): 0.022" (0.55mm); LastUpdated: 21-Jan-20 12:16:19 AM; Lifecycle Status: Active; Minimum Order: 1; Number of Terminations: 2; Operating Temperature: -55°C ~ 155°C; Package / Case: 0603 (1608 Metric); Packaging: TapeAndReel; PartId: 24202; Part Status: Active; Price: 0.01; Ratings: AEC-Q200; Resistance: 21.5 Ohms; Series: ERJ; Size / Dimension: 0.063" L x 0.031" W (1.60mm x 0.80mm); Supplier 1: DigiKey; Supplier Part Number 1: P21.5HCT-ND; Supplier Device Package: 0603; Tolerance: ±1%
R11 = RNCS0603BKE10K0: as R5 on sheet 5V_buck; Part Number: RNCS0603BKE10K0; Value: 10 kOhms; ComponentLink1Description: Datasheet; ComponentLink1URL: https://www.seielect.com/catalog/sei-rncs_rnch.pdf; ComponentLink2Description: DigiKey Link; ComponentLink2URL: http://digikey.com/product-detail/en/stackpole-electronics-inc/RNCS0603BKE10K0/RNCS0603BKE10K0CT-ND/1800113; Composition: Thin Film; Device Package: 0603 (1608 Metric); Features: Anti-Corrosive, Automotive AEC-Q200, Moisture Resistant; Height - Seated (Max): 0.022" (0.55mm); LastUpdated: 13-Aug-20 10:37:13 AM; Lifecycle Status: Active; Minimum Order: 1; Number of Terminations: 2; Operating Temperature: -55°C ~ 155°C; Package / Case: 0603 (1608 Metric); Packaging: TapeAndReel; PartId: 4838; Part Status: Active; Price: 0.08; Ratings: AEC-Q200; Resistance: 10 kOhms; Series: RNCS; Size / Dimension: 0.061" L x 0.031" W (1.55mm x 0.80mm); Supplier 1: DigiKey; Supplier Part Number 1: RNCS0603BKE10K0CT-ND; Supplier Device Package: 0603; Tolerance: ±0.1%
U1 = PIC32MZ0512EFE064-I/PT: 32-bit Microcontrollers - MCU 32-BIT MCU 512KB FL 128KB RAM, No Crypto; MF: Microchip; MP: PIC32MZ2048EFG064T-I/PT; Price: None; Value: *; SnapEDA_Link: https://www.snapeda.com/parts/PIC32MZ2048EFG064T-I/PT/Microchip/view-part/565997/?ref=snap; Package: TQFP-64 Microchip; Availability: Unavailable

## Nets that join several sheets
3V3: U_Power/U_3V3_LDO (C10_2.1 C11_2.2 U5_2.5), PIC32MZ (15 pins)
3V3_XBee: Top (C6.2 U2.1), U_Power/U_3V3_LDO (C10_1.1 C11_1.2 U5_1.5)
5V: Top (P1.1), Power (R10.1), 5V_buck (5 pins), U_Power/U_3V3_LDO (C8_2.2 C9_2.1 R16_2.2 U5_2.1), U_Power/U_3V3_LDO (C8_1.2 C9_1.1 R16_1.2 U5_1.1)
GND: Top (C6.1 P1.2 U2.10), Power (C26.2 D2.2 P5.1), 5V_buck (6 pins), U_Power/U_3V3_LDO (5 pins), U_Power/U_3V3_LDO (5 pins), PIC32MZ (25 pins)
VBAT: Power (C26.1 P5.2), 5V_buck (C1.2 C2.1 R5.2 U4.3)
INT: Top (P1.8), PIC32MZ (U1.30)
SCL: Top (P1.3), PIC32MZ (U1.42)
SDA: Top (P1.4), PIC32MZ (U1.41)
XBEE_DIN: Top (U2.3), PIC32MZ (R6.1)
XBEE_DOUT: Top (U2.2), PIC32MZ (R7.1)

## Assembly variants
Main: not fitted P1 P2 P3 R14